# Altium project PCB_Project1.PrjPCB
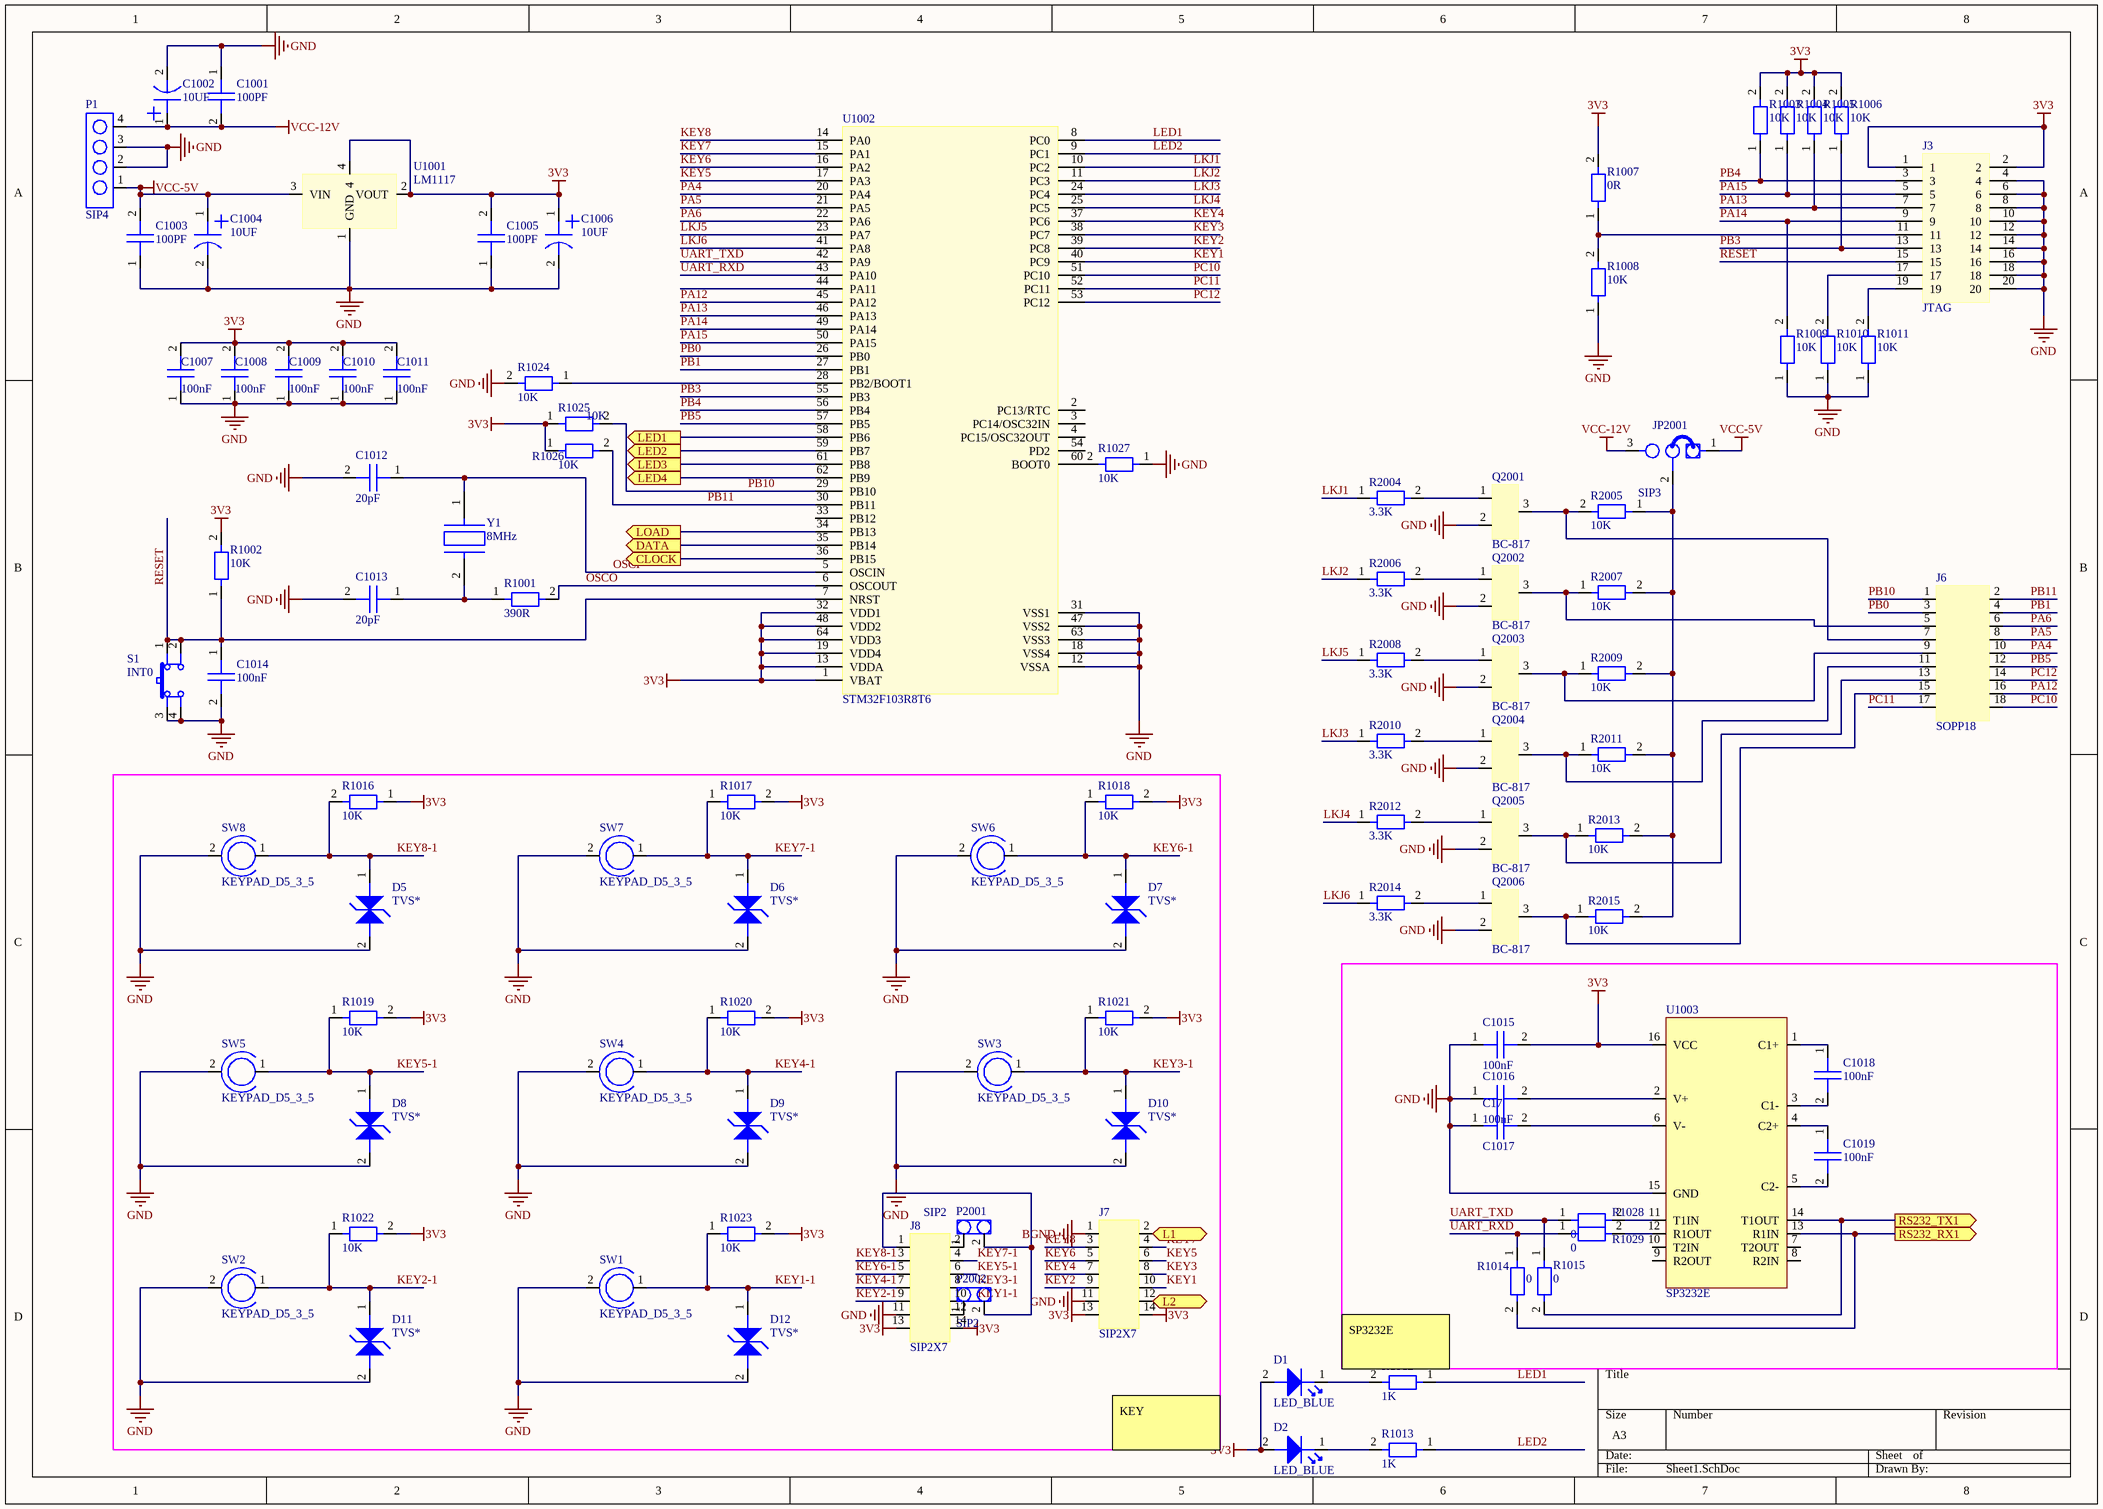
[diagram p0: Sheet1.SchDoc]
3 sheets, 236 parts. Net scope: flat (ports and power ports of the same name join across sheets).
Board file: Sheer1.PcbDoc
Sheets:
  Sheet1.SchDoc
  Sheet2.SchDoc
  Sheet3.SchDoc

## Sheet Sheet1.SchDoc
size A3

### Parts
C17  C1017  [0603]
C1001  100PF  [0603]
C1002  10UF  [7343]
C1003  100PF  [0603]
C1004  10UF  [7343]
C1005  100PF  [0603]
C1006  10UF  [7343]
C1007  100nF  [0603]
C1008  100nF  [0603]
C1009  100nF  [0603]
C1010  100nF  [0603]
C1011  100nF  [0603]
C1012  20pF  [0603]
C1013  20pF  [0603]
C1014  100nF  [0603]
C1015  100nF  [0603]
C1016  100nF  [0603]
C1018  100nF  [0603]
C1019  100nF  [0603]
D1  LED_BLUE  [0603]
D2  LED_BLUE  [0603]
D5  TVS*  [0603]
D6  TVS*  [0603]
D7  TVS*  [0603]
D8  TVS*  [0603]
D9  TVS*  [0603]
D10  TVS*  [0603]
D11  TVS*  [0603]
D12  TVS*  [0603]
J3  JTAG  [SOP20]
J6  SOPP18  [SOP18]
J7  SIP2X7  [DB2X7-2.54]
J8  SIP2X7  [DB2X7-2.54]
JP2001  SIP3  [SIP3]
P1  SIP4  [SIP4]
P2001  SIP2  [1.25T-2P]
P2002  SIP2  [1.25T-2P]
Q2001  BC-817  [S9013]
Q2002  BC-817  [S9013]
Q2003  BC-817  [S9013]
Q2004  BC-817  [S9013]
Q2005  BC-817  [S9013]
Q2006  BC-817  [S9013]
R1001  390R  [0603]
R1002  10K  [0603]
R1003  10K  [0603]
R1004  10K  [0603]
R1005  10K  [0603]
R1006  10K  [0603]
R1007  0R  [0603]
R1008  10K  [0603]
R1009  10K  [0603]
R1010  10K  [0603]
R1011  10K  [0603]
R1012  1K  [0603]
R1013  1K  [0603]
R1014  0  [0603]
R1015  0  [0603]
R1016  10K  [0603]
R1017  10K  [0603]
R1018  10K  [0603]
R1019  10K  [0603]
R1020  10K  [0603]
R1021  10K  [0603]
R1022  10K  [0603]
R1023  10K  [0603]
R1024  10K  [0603]
R1025  10K  [0603]
R1026  10K  [0603]
R1027  10K  [0603]
R1028  0  [0603]
R1029  0  [0603]
R2004  3.3K  [0603]
R2005  10K  [0603]
R2006  3.3K  [0603]
R2007  10K  [0603]
R2008  3.3K  [0603]
R2009  10K  [0603]
R2010  3.3K  [0603]
R2011  10K  [0603]
R2012  3.3K  [0603]
R2013  10K  [0603]
R2014  3.3K  [0603]
R2015  10K  [0603]
S1  INT0  [SW]
SW1  KEYPAD_D5_3_5  [AJB-9MM]
SW2  KEYPAD_D5_3_5  [AJB-9MM]
SW3  KEYPAD_D5_3_5  [AJB-9MM]
SW4  KEYPAD_D5_3_5  [AJB-9MM]
SW5  KEYPAD_D5_3_5  [AJB-9MM]
SW6  KEYPAD_D5_3_5  [AJB-9MM]
SW7  KEYPAD_D5_3_5  [AJB-9MM]
SW8  KEYPAD_D5_3_5  [AJB-9MM]
U1001  LM1117  [LM1117]
U1002  STM32F103R8T6  [STM32F103R8T6]
U1003  SP3232E  [SP3232E-SOIC]
Y1  8MHz  [HC-49S]

### Ports
CLOCK (out), DATA (out), L1 (out), L2 (out), LED1 (out), LED2 (out), LED3 (out), LED4 (out), LOAD (out), RS232_RX1 (out), RS232_TX1 (out)

### Nets
3V3: C1005.2 C1006.1 C1007.2 C1008.2 C1009.2 C1010.2 C1011.2 C1015.2 D1.2 D2.2 J3.1 J3.2 J7.13 J7.14 J8.13 J8.14 R1002.2 R1003.2 R1004.2 R1005.2 R1006.2 R1007.2 R1016.1 R1017.2 R1018.2 R1019.2 R1020.2 R1021.2 R1022.2 R1023.2 R1025.1 R1026.1 U1001.2(VOUT) U1001.4 U1002.1(VBAT) U1002.13(VDDA) U1002.19(VDD4) U1002.32(VDD1) U1002.48(VDD2) U1002.64(VDD3) U1003.16(VCC)
BGND: J7.1
GND: C17.1 C1001.1 C1002.2 C1003.1 C1004.2 C1005.1 C1006.2 C1007.1 C1008.1 C1009.1 C1010.1 C1011.1 C1012.2 C1013.2 C1014.2 C1015.1 C1016.1 D5.2 D6.2 D7.2 D8.2 D9.2 D10.2 D11.2 D12.2 J3.4 J3.6 J3.8 J3.10 J3.12 J3.14 J3.16 J3.18 J3.20 J7.11 J8.11 P1.2 P1.3 Q2001.2 Q2002.2 Q2003.2 Q2004.2 Q2005.2 Q2006.2 R1008.1 R1009.1 R1010.1 R1011.1 R1024.2 R1027.1 S1.3 S1.4 SW1.2 SW2.2 SW3.2 SW4.2 SW5.2 SW6.2 SW7.2 SW8.2 U1001.1(GND) U1002.12(VSSA) U1002.18(VSS4) U1002.31(VSS1) U1002.47(VSS2) U1002.63(VSS3) U1003.15(GND)
VCC-5V: C1003.2 C1004.1 JP2001.1 P1.1 U1001.3(VIN)
VCC-12V: C1001.2 C1002.1 JP2001.3 P1.4
KEY1: J7.10 U1002.40(PC9)
KEY1-1: D12.1 J8.10 R1023.1 SW1.1
KEY2: J7.9 U1002.39(PC8)
KEY2-1: D11.1 J8.9 R1022.1 SW2.1
KEY3: J7.8 U1002.38(PC7)
KEY3-1: D10.1 J8.8 R1021.1 SW3.1
KEY4: J7.7 U1002.37(PC6)
KEY4-1: D9.1 J8.7 R1020.1 SW4.1
KEY5: J7.6 U1002.17(PA3)
KEY5-1: D8.1 J8.6 R1019.1 SW5.1
KEY6: J7.5 U1002.16(PA2)
KEY6-1: D7.1 J8.5 R1018.1 SW6.1
KEY7: J7.4 U1002.15(PA1)
KEY7-1: D6.1 J8.4 R1017.1 SW7.1
KEY8: J7.3 U1002.14(PA0)
KEY8-1: D5.1 J8.3 R1016.2 SW8.1
LED1: R1012.1 U1002.8(PC0)
LED2: R1013.1 U1002.9(PC1)
LKJ1: R2004.1 U1002.10(PC2)
LKJ2: R2006.1 U1002.11(PC3)
LKJ3: R2010.1 U1002.24(PC4)
LKJ4: R2012.1 U1002.25(PC5)
LKJ5: R2008.1 U1002.23(PA7)
LKJ6: R2014.1 U1002.41(PA8)
OSCI: C1012.1 U1002.5(OSCIN) Y1.1
OSCO: R1001.2 U1002.6(OSCOUT)
PA4: J6.10 U1002.20(PA4)
PA5: J6.8 U1002.21(PA5)
PA6: J6.6 U1002.22(PA6)
PA12: J6.16 U1002.45(PA12)
PA13: J3.7 R1005.1 U1002.46(PA13)
PA14: J3.9 R1009.2 U1002.49(PA14)
PA15: J3.5 R1004.1 U1002.50(PA15)
PB0: J6.3 U1002.26(PB0)
PB1: J6.4 U1002.27(PB1)
PB3: J3.13 R1006.1 U1002.55(PB3)
PB4: J3.3 R1003.1 U1002.56(PB4)
PB5: J6.12 U1002.57(PB5)
PB10: J6.1 R1025.2 U1002.29(PB10)
PB11: J6.2 R1026.2 U1002.30(PB11)
PC10: J6.18 U1002.51(PC10)
PC11: J6.17 U1002.52(PC11)
PC12: J6.14 U1002.53(PC12)
RESET: C1014.1 J3.15 R1002.1 S1.1 S1.2 U1002.7(NRST)
UART_RXD: R1014.1 R1029.1 U1002.43(PA10)
UART_TXD: R1015.1 R1028.1 U1002.42(PA9)
NetC17_2: C17.2 U1003.6(V-)
NetC1013_1: C1013.1 R1001.1 Y1.2
NetC1016_2: C1016.2 U1003.2(V+)
NetC1018_1: C1018.1 U1003.1(C1+)
NetC1018_2: C1018.2 U1003.3(C1-)
NetC1019_1: C1019.1 U1003.4(C2+)
NetC1019_2: C1019.2 U1003.5(C2-)
NetC2008_2: J7.2 ; port L1
NetC2019_2: J7.12 ; port L2
NetD1_1: D1.1 R1012.2
NetD2_1: D2.1 R1013.2
NetJ3_11: J3.11 R1007.1 R1008.2
NetJ3_17: J3.17 R1010.2
NetJ3_19: J3.19 R1011.2
NetJ6_5: J6.5 Q2002.3 R2007.1
NetJ6_7: J6.7 Q2001.3 R2005.2
NetJ6_9: J6.9 Q2003.3 R2009.1
NetJ6_11: J6.11 Q2004.3 R2011.1
NetJ6_13: J6.13 Q2005.3 R2013.1
NetJ6_15: J6.15 Q2006.3 R2015.1
NetJ8_1: J8.1 P2001.2 P2002.2
NetJ8_2: J8.2 P2001.1
NetJ8_12: J8.12 P2002.1
NetJ2002_5: R1014.2 U1003.13(R1IN) ; port RS232_RX1
NetJ2002_6: R1015.2 U1003.14(T1OUT) ; port RS232_TX1
NetJP2001_2: JP2001.2 R2005.1 R2007.2 R2009.2 R2011.2 R2013.2 R2015.2
NetQ2001_1: Q2001.1 R2004.2
NetQ2002_1: Q2002.1 R2006.2
NetQ2003_1: Q2003.1 R2008.2
NetQ2004_1: Q2004.1 R2010.2
NetQ2005_1: Q2005.1 R2012.2
NetQ2006_1: Q2006.1 R2014.2
NetR1024_1: R1024.1 U1002.28(PB2/BOOT1)
NetR1027_2: R1027.2 U1002.60(BOOT0)
NetR1028_2: R1028.2 U1003.11(T1IN)
NetR1029_2: R1029.2 U1003.12(R1OUT)
NetR3001_1: U1002.58(PB6) ; port LED1
NetR3002_1: U1002.59(PB7) ; port LED2
NetR3004_1: U1002.61(PB8) ; port LED3
NetR3005_1: U1002.62(PB9) ; port LED4
NetU1002_34: U1002.34(PB13) ; port LOAD
NetU1002_35: U1002.35(PB14) ; port DATA
NetU1002_36: U1002.36(PB15) ; port CLOCK

Not connected (* = marked no-connect by the designer): U1002 2(PC13/RTC) 3(PC14/OSC32IN) 4(PC15/OSC32OUT) 33(PB12) 44(PA11) 54(PD2); U1003 7(T2OUT) 8(R2IN) 9(R2OUT) 10(T2IN)

### Notes on the sheet
- (near R1012) SP3232E
- KEY

### Library data of the parts
C17 C1001 C1003 C1005 C1007-C1016 C1018 C1019 = C
C1002 C1004 C1006 = JC
D5-D12 = TVS
R1001-R1029 R2004-R2015 = R
Y1 = CRYSTAL

## Sheet Sheet2.SchDoc
size A3
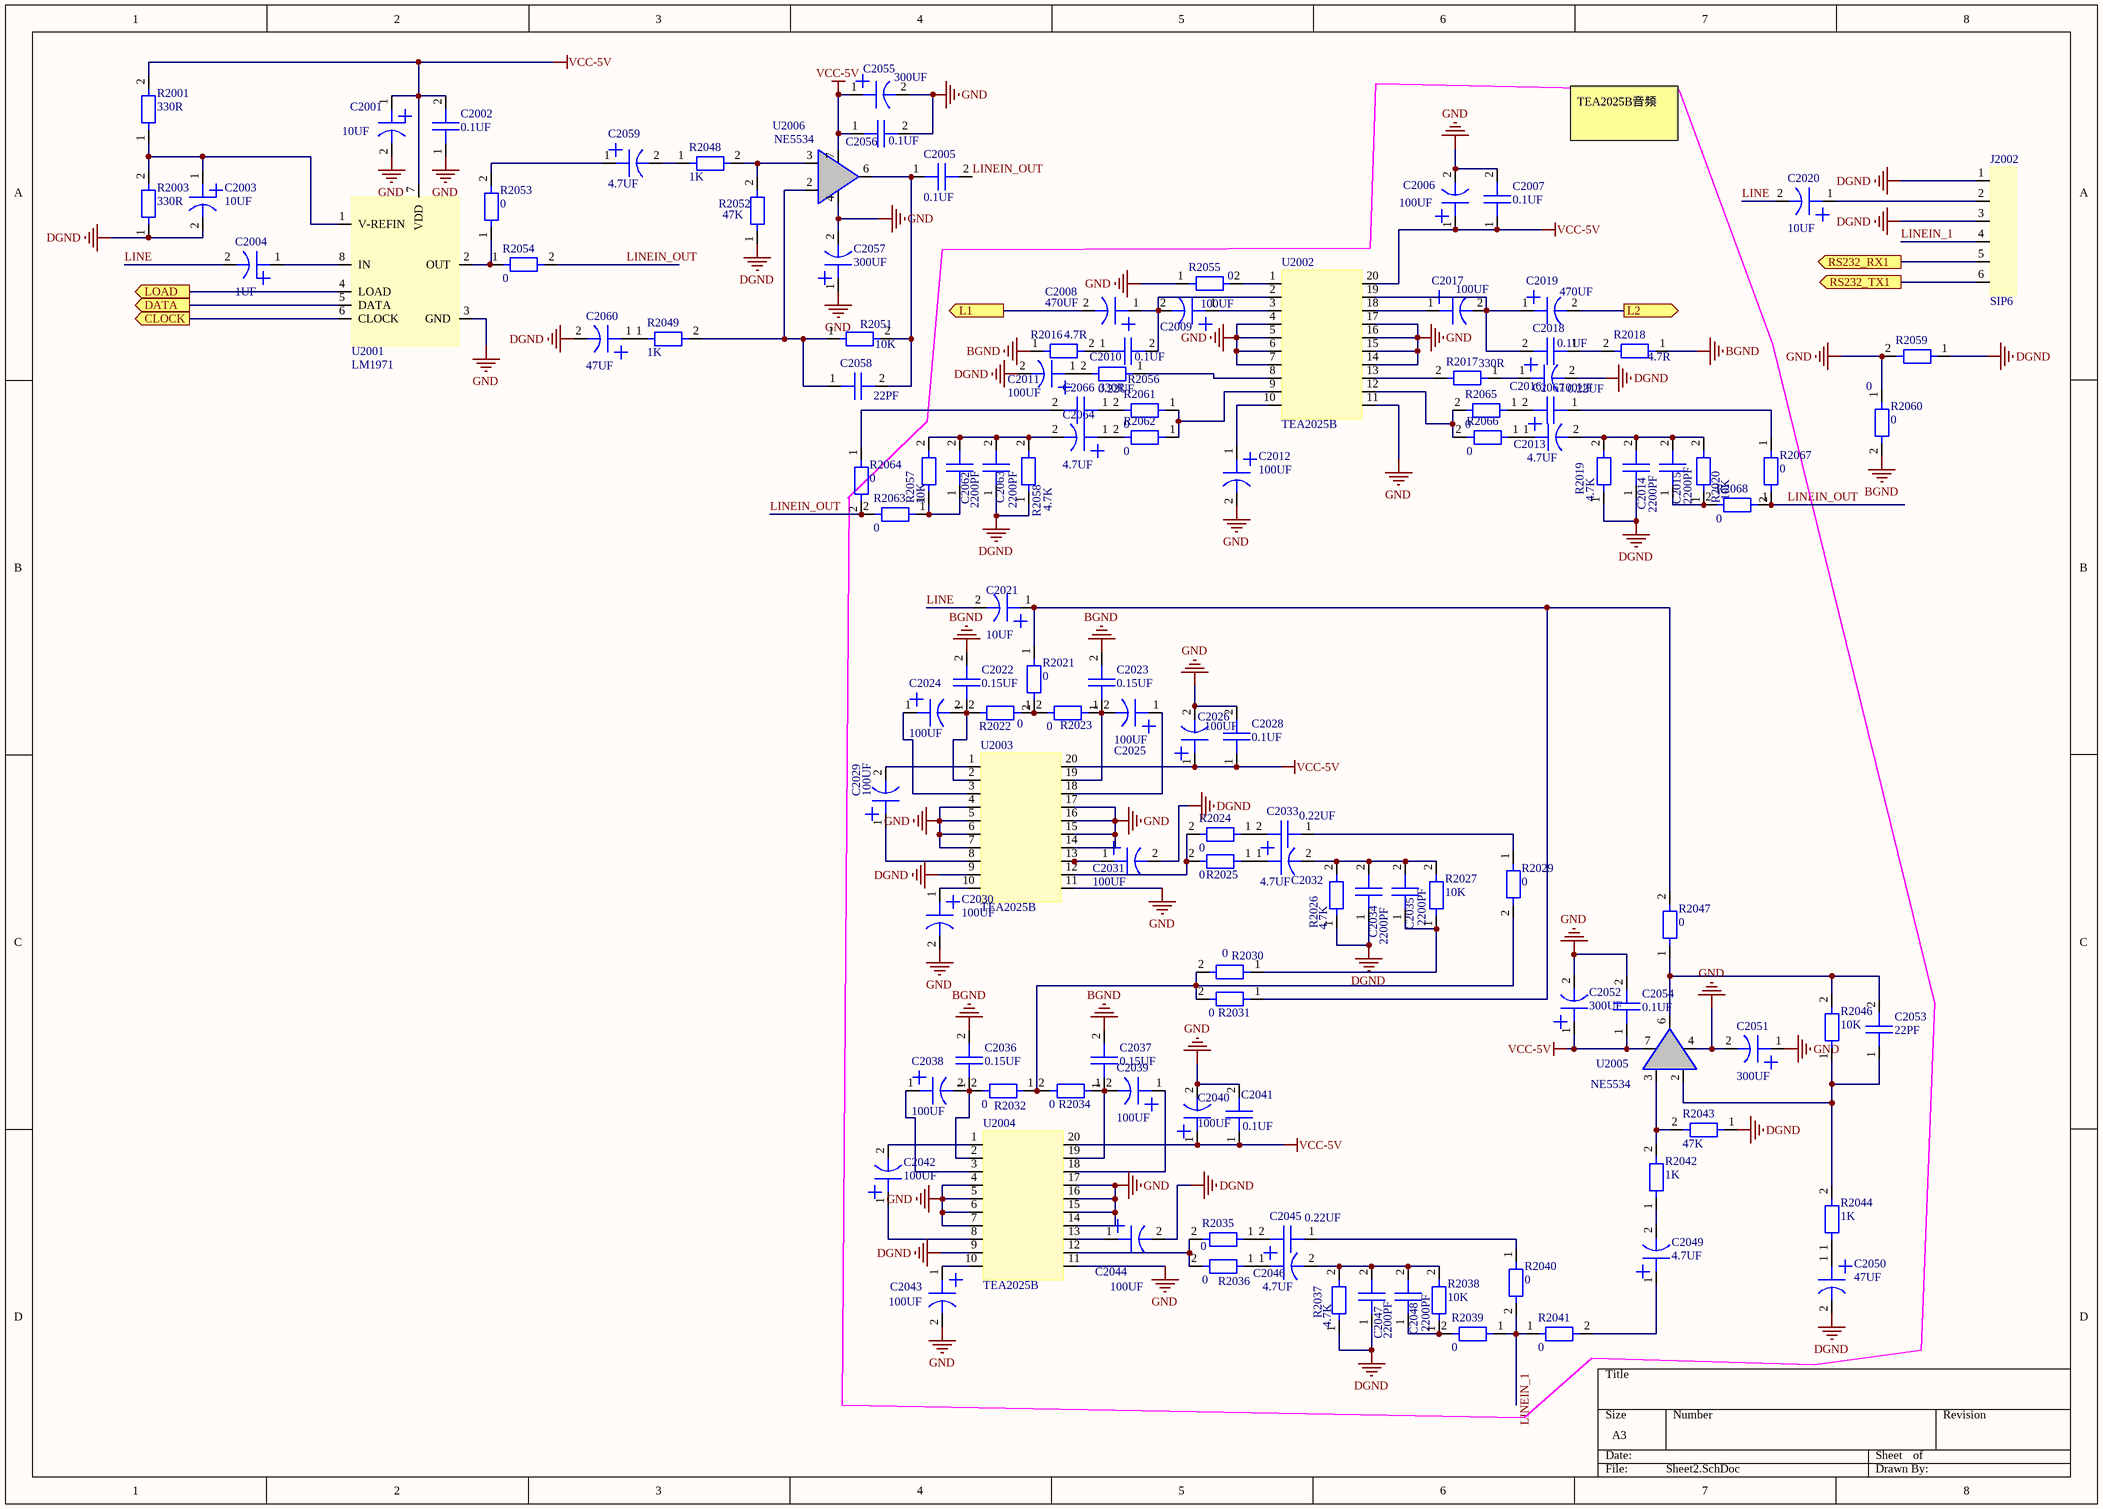
[diagram p1: Sheet2.SchDoc]

### Parts
C2001  10UF  [7343]
C2002  0.1UF  [0603]
C2003  10UF  [7343]
C2004  1UF  [7343]
C2005  0.1UF  [0603]
C2006  100UF  [7343]
C2007  0.1UF  [0603]
C2008  470UF  [7343]
C2009  100UF  [7343]
C2010  0.1UF  [0603]
C2011  100UF  [7343]
C2012  100UF  [7343]
C2013  4.7UF  [7343]
C2014  2200PF  [0603]
C2015  2200PF  [0603]
C2016  100UF  [7343]
C2017  100UF  [7343]
C2018  0.1UF  [0603]
C2019  470UF  [7343]
C2020  10UF  [7343]
C2021  10UF  [7343]
C2022  0.15UF  [0603]
C2023  0.15UF  [0603]
C2024  100UF  [7343]
C2025  100UF  [7343]
C2026  100UF  [7343]
C2028  0.1UF  [0603]
C2029  100UF  [7343]
C2030  100UF  [7343]
C2031  100UF  [7343]
C2032  4.7UF  [7343]
C2033  0.22UF  [0603]
C2034  2200PF  [0603]
C2035  2200PF  [0603]
C2036  0.15UF  [0603]
C2037  0.15UF  [0603]
C2038  100UF  [7343]
C2039  100UF  [7343]
C2040  100UF  [7343]
C2041  0.1UF  [0603]
C2042  100UF  [7343]
C2043  100UF  [7343]
C2044  100UF  [7343]
C2045  0.22UF  [0603]
C2046  4.7UF  [7343]
C2047  2200PF  [0603]
C2048  2200PF  [0603]
C2049  4.7UF  [7343]
C2050  47UF  [7343]
C2051  300UF  [7343]
C2052  300UF  [7343]
C2053  22PF  [0603]
C2054  0.1UF  [0603]
C2055  300UF  [7343]
C2056  0.1UF  [0603]
C2057  300UF  [7343]
C2058  22PF  [0603]
C2059  4.7UF  [7343]
C2060  47UF  [7343]
C2062  2200PF  [0603]
C2063  2200PF  [0603]
C2064  4.7UF  [7343]
C2066  0.22UF  [0603]
C2067  0.22UF  [0603]
J2002  SIP6  [SIP6]
R2001  330R  [0603]
R2003  330R  [0603]
R2016  4.7R  [0603]
R2017  330R  [0603]
R2018  4.7R  [0603]
R2019  4.7K  [0603]
R2020  10K  [0603]
R2021  0  [0603]
R2022  0  [0603]
R2023  0  [0603]
R2024  0  [0603]
R2025  0  [0603]
R2026  4.7K  [0603]
R2027  10K  [0603]
R2029  0  [0603]
R2030  0  [0603]
R2031  0  [0603]
R2032  0  [0603]
R2034  0  [0603]
R2035  0  [0603]
R2036  0  [0603]
R2037  4.7K  [0603]
R2038  10K  [0603]
R2039  0  [0603]
R2040  0  [0603]
R2041  0  [0603]
R2042  1K  [0603]
R2043  47K  [0603]
R2044  1K  [0603]
R2046  10K  [0603]
R2047  0  [0603]
R2048  1K  [0603]
R2049  1K  [0603]
R2051  10K  [0603]
R2052  47K  [0603]
R2053  0  [0603]
R2054  0  [0603]
R2055  0  [0603]
R2056  330R  [0603]
R2057  10K  [0603]
R2058  4.7K  [0603]
R2059  0  [0603]
R2060  0  [0603]
R2061  0  [0603]
R2062  0  [0603]
R2063  0  [0603]
R2064  0  [0603]
R2065  0  [0603]
R2066  0  [0603]
R2067  0  [0603]
R2068  0  [0603]
U2001  LM1971  [TJA1040]
U2002  TEA2025B  [TEA2025B]
U2003  TEA2025B  [TEA2025B]
U2004  TEA2025B  [TEA2025B]
U2005  NE5534  [SP2526A]
U2006  NE5534  [SP2526A]

### Ports
CLOCK (out), DATA (out), L1 (out), L2 (out), LOAD (out), RS232_RX1 (out), RS232_TX1 (out)

### Nets
BGND: C2022.2 C2023.2 C2036.2 C2037.2 R2016.1 R2018.1 R2060.2
DGND: C2003.2 C2011.2 C2014.1 C2016.2 C2031.2 C2034.1 C2044.2 C2047.1 C2050.2 C2060.2 C2063.1 J2002.1 J2002.3 R2003.1 R2019.1 R2026.1 R2037.1 R2043.1 R2052.1 R2058.1 R2059.1 U2003.9 U2004.9
GND: C2001.2 C2002.1 C2006.2 C2007.2 C2012.2 C2026.2 C2028.2 C2030.2 C2040.2 C2041.2 C2043.2 C2051.1 C2051.2 C2052.2 C2054.2 C2055.2 C2056.2 C2057.1 C2057.2 R2055.1 R2059.2 R2060.1 U2001.3(GND) U2002.4 U2002.5 U2002.6 U2002.7 U2002.11 U2002.14 U2002.15 U2002.16 U2002.17 U2003.4 U2003.5 U2003.6 U2003.7 U2003.11 U2003.14 U2003.15 U2003.16 U2003.17 U2004.4 U2004.5 U2004.6 U2004.7 U2004.11 U2004.14 U2004.15 U2004.16 U2004.17 U2005.4 U2006.4
VCC-5V: C2001.1 C2002.2 C2006.1 C2007.1 C2026.1 C2028.1 C2040.1 C2041.1 C2052.1 C2054.1 C2055.1 C2056.1 R2001.2 U2001.7(VDD) U2002.20 U2003.20 U2004.20 U2005.7 U2006.7
LINE: C2004.2 C2020.2 C2021.2
LINEIN_1: J2002.4 R2039.1 R2040.2 R2041.1
LINEIN_OUT: C2005.2 R2054.2 R2063.2 R2064.2 R2067.2 R2068.1
NetC2003_1: C2003.1 R2001.1 R2003.2 U2001.1(V-REFIN)
NetC2004_1: C2004.1 U2001.8(IN)
NetC2005_1: C2005.1 C2058.2 R2051.2 U2006.6
NetC2008_1: C2008.1 C2009.2 C2010.2 U2002.2
NetC2008_2: C2008.2 ; port L1
NetC2009_1: C2009.1 U2002.3
NetC2010_1: C2010.1 R2016.2
NetC2011_1: C2011.1 R2056.2
NetC2012_1: C2012.1 U2002.10
NetC2013_1: C2013.1 R2066.1
NetC2013_2: C2013.2 C2014.2 C2015.2 R2019.2 R2020.2
NetC2015_1: C2015.1 R2020.1 R2068.2
NetC2016_1: C2016.1 R2017.1
NetC2017_1: C2017.1 U2002.18
NetC2017_2: C2017.2 C2018.2 C2019.1 U2002.19
NetC2018_1: C2018.1 R2018.2
NetC2019_2: C2019.2 ; port L2
NetC2020_1: C2020.1 J2002.2
NetC2021_1: C2021.1 R2021.1 R2031.1 R2047.2
NetC2022_1: C2022.1 C2024.2 R2022.2 U2003.2
NetC2023_1: C2023.1 C2025.2 R2023.1 U2003.19
NetC2024_1: C2024.1 U2003.3
NetC2025_1: C2025.1 U2003.18
NetC2029_1: C2029.1 U2003.8
NetC2029_2: C2029.2 U2003.1
NetC2030_1: C2030.1 U2003.10
NetC2031_1: C2031.1 U2003.13
NetC2032_1: C2032.1 R2025.1
NetC2032_2: C2032.2 C2034.2 C2035.2 R2026.2 R2027.2
NetC2033_1: C2033.1 R2029.1
NetC2033_2: C2033.2 R2024.1
NetC2035_1: C2035.1 R2027.1 R2030.1
NetC2036_1: C2036.1 C2038.2 R2032.2 U2004.2
NetC2037_1: C2037.1 C2039.2 R2034.1 U2004.19
NetC2038_1: C2038.1 U2004.3
NetC2039_1: C2039.1 U2004.18
NetC2042_1: C2042.1 U2004.8
NetC2042_2: C2042.2 U2004.1
NetC2043_1: C2043.1 U2004.10
NetC2044_1: C2044.1 U2004.13
NetC2045_1: C2045.1 R2040.1
NetC2045_2: C2045.2 R2035.1
NetC2046_1: C2046.1 R2036.1
NetC2046_2: C2046.2 C2047.2 C2048.2 R2037.2 R2038.2
NetC2048_1: C2048.1 R2038.1 R2039.2
NetC2049_1: C2049.1 R2041.2
NetC2049_2: C2049.2 R2042.1
NetC2050_1: C2050.1 R2044.1
NetC2053_1: C2053.1 R2044.2 R2046.1 U2005.2
NetC2053_2: C2053.2 R2046.2 R2047.1 U2005.6
NetC2058_1: C2058.1 R2049.2 R2051.1 U2006.2
NetC2059_1: C2059.1 R2053.2
NetC2059_2: C2059.2 R2048.1
NetC2060_1: C2060.1 R2049.1
NetC2062_1: C2062.1 R2057.1 R2063.1
NetC2062_2: C2062.2 C2063.2 C2064.2 R2057.2 R2058.2
NetC2064_1: C2064.1 R2062.2
NetC2066_1: C2066.1 R2061.2
NetC2066_2: C2066.2 R2064.1
NetC2067_1: C2067.1 R2067.1
NetC2067_2: C2067.2 R2065.1
NetJ2002_5: J2002.5 ; port RS232_RX1
NetJ2002_6: J2002.6 ; port RS232_TX1
NetR2017_2: R2017.2 U2002.13
NetR2021_2: R2021.2 R2022.1 R2023.2
NetR2024_2: R2024.2 R2025.2 U2003.12
NetR2029_2: R2029.2 R2030.2 R2031.2 R2032.1 R2034.2
NetR2035_2: R2035.2 R2036.2 U2004.12
NetR2042_2: R2042.2 R2043.2 U2005.3
NetR2048_2: R2048.2 R2052.2 U2006.3
NetR2053_1: R2053.1 R2054.1 U2001.2(OUT)
NetR2055_2: R2055.2 U2002.1
NetR2056_1: R2056.1 U2002.8
NetR2061_1: R2061.1 R2062.1 U2002.9
NetR2065_2: R2065.2 R2066.2 U2002.12
NetU1002_34: U2001.4(LOAD) ; port LOAD
NetU1002_35: U2001.5(DATA) ; port DATA
NetU1002_36: U2001.6(CLOCK) ; port CLOCK

### Notes on the sheet
- TEA2025B音频

### Library data of the parts
C2001 C2003 C2004 = EC
C2002 C2005 C2007 C2010 C2014 C2015 C2018 C2022 C2023 C2028 C2033-C2037 C2041 C2045 C2047 C2048 C2053 C2054 C2056 C2058 C2062 C2063 C2066 C2067 = C
C2006 C2008 C2009 C2011-C2013 C2016 C2017 C2019-C2021 C2024-C2026 C2029-C2032 C2038-C2040 C2042-C2044 C2046 C2049-C2052 C2055 C2057 C2059 C2060 C2064 = JC
R2001 R2003 R2016-R2027 R2029-R2032 R2034-R2044 R2046-R2049 R2051-R2068 = R

## Sheet Sheet3.SchDoc
size A3
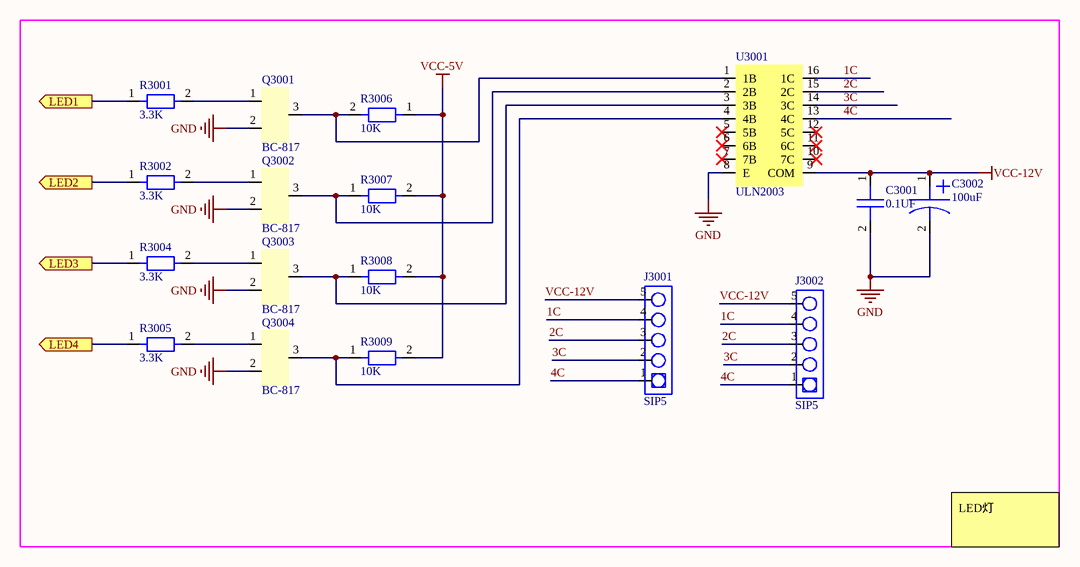
[diagram p2: Sheet3.SchDoc]

### Parts
C3001  0.1UF  [0603]
C3002  100uF  [7343]
J3001  SIP5  [SIP5]
J3002  SIP5  [SIP5]
Q3001  BC-817  [S9013]
Q3002  BC-817  [S9013]
Q3003  BC-817  [S9013]
Q3004  BC-817  [S9013]
R3001  3.3K  [0603]
R3002  3.3K  [0603]
R3004  3.3K  [0603]
R3005  3.3K  [0603]
R3006  10K  [0603]
R3007  10K  [0603]
R3008  10K  [0603]
R3009  10K  [0603]
U3001  ULN2003  [ULN2003A]

### Ports
LED1 (out), LED2 (out), LED3 (out), LED4 (out)

### Nets
GND: C3001.2 C3002.2 Q3001.2 Q3002.2 Q3003.2 Q3004.2 U3001.8(E)
VCC-5V: R3006.1 R3007.2 R3008.2 R3009.2
VCC-12V: C3001.1 C3002.1 J3001.5 J3002.5 U3001.9(COM)
1C: J3001.4 J3002.4 U3001.16(1C)
2C: J3001.3 J3002.3 U3001.15(2C)
3C: J3001.2 J3002.2 U3001.14(3C)
4C: J3001.1 J3002.1 U3001.13(4C)
NetQ3001_1: Q3001.1 R3001.2
NetQ3001_3: Q3001.3 R3006.2 U3001.1(1B)
NetQ3002_1: Q3002.1 R3002.2
NetQ3002_3: Q3002.3 R3007.1 U3001.2(2B)
NetQ3003_1: Q3003.1 R3004.2
NetQ3003_3: Q3003.3 R3008.1 U3001.3(3B)
NetQ3004_1: Q3004.1 R3005.2
NetQ3004_3: Q3004.3 R3009.1 U3001.4(4B)
NetR3001_1: R3001.1 ; port LED1
NetR3002_1: R3002.1 ; port LED2
NetR3004_1: R3004.1 ; port LED3
NetR3005_1: R3005.1 ; port LED4

Not connected (* = marked no-connect by the designer): U3001 5(5B)* 6(6B)* 7(7B)* 10(7C)* 11(6C)* 12(5C)*

### Notes on the sheet
- LED灯

### Library data of the parts
C3001 = C
C3002 = 极性电容
R3001 R3002 R3004-R3009 = R

## Nets that join several sheets
BGND: Sheet1 (J7.1), Sheet2 (7 pins)
GND: Sheet1 (67 pins), Sheet2 (52 pins), Sheet3 (7 pins)
VCC-5V: Sheet1 (5 pins), Sheet2 (19 pins), Sheet3 (R3006.1 R3007.2 R3008.2 R3009.2)
VCC-12V: Sheet1 (C1001.2 C1002.1 JP2001.3 P1.4), Sheet3 (5 pins)
NetC2008_2: Sheet1 (J7.2), Sheet2 (C2008.2)
NetC2019_2: Sheet1 (J7.12), Sheet2 (C2019.2)
NetJ2002_5: Sheet1 (R1014.2 U1003.13), Sheet2 (J2002.5)
NetJ2002_6: Sheet1 (R1015.2 U1003.14), Sheet2 (J2002.6)
NetR3001_1: Sheet1 (U1002.58), Sheet3 (R3001.1)
NetR3002_1: Sheet1 (U1002.59), Sheet3 (R3002.1)
NetR3004_1: Sheet1 (U1002.61), Sheet3 (R3004.1)
NetR3005_1: Sheet1 (U1002.62), Sheet3 (R3005.1)
NetU1002_34: Sheet1 (U1002.34), Sheet2 (U2001.4)
NetU1002_35: Sheet1 (U1002.35), Sheet2 (U2001.5)
NetU1002_36: Sheet1 (U1002.36), Sheet2 (U2001.6)